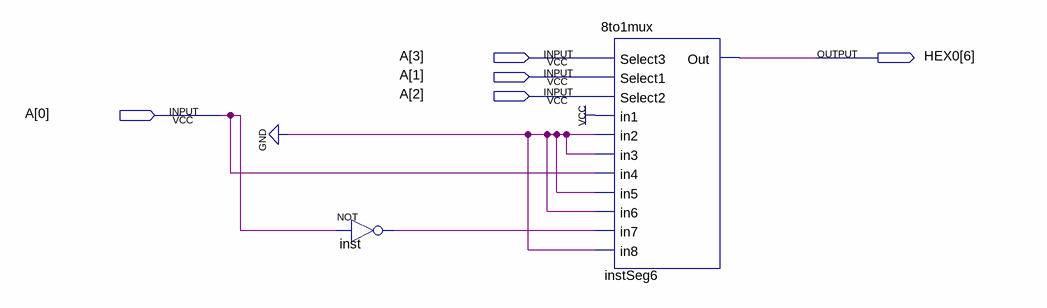
[diagram p0: schematic sheet]
// Quartus schematic seg6.bdf as structural Verilog: 2 symbols, 5 pins
module seg6 (
  input  [3:0] A,
  output [6:6] HEX0
);

  wire inst_out;

  not inst (inst_out, A[0]);
  \8to1mux  instSeg6 (
    .Select3(A[3]), .Select1(A[1]), .Select2(A[2]), .in1(1'b1), .in2(1'b0), .in3(1'b0), .in4(A[0]),
    .in5(1'b0), .in6(1'b0), .in7(inst_out), .in8(1'b0), .Out(HEX0[6]));
endmodule
